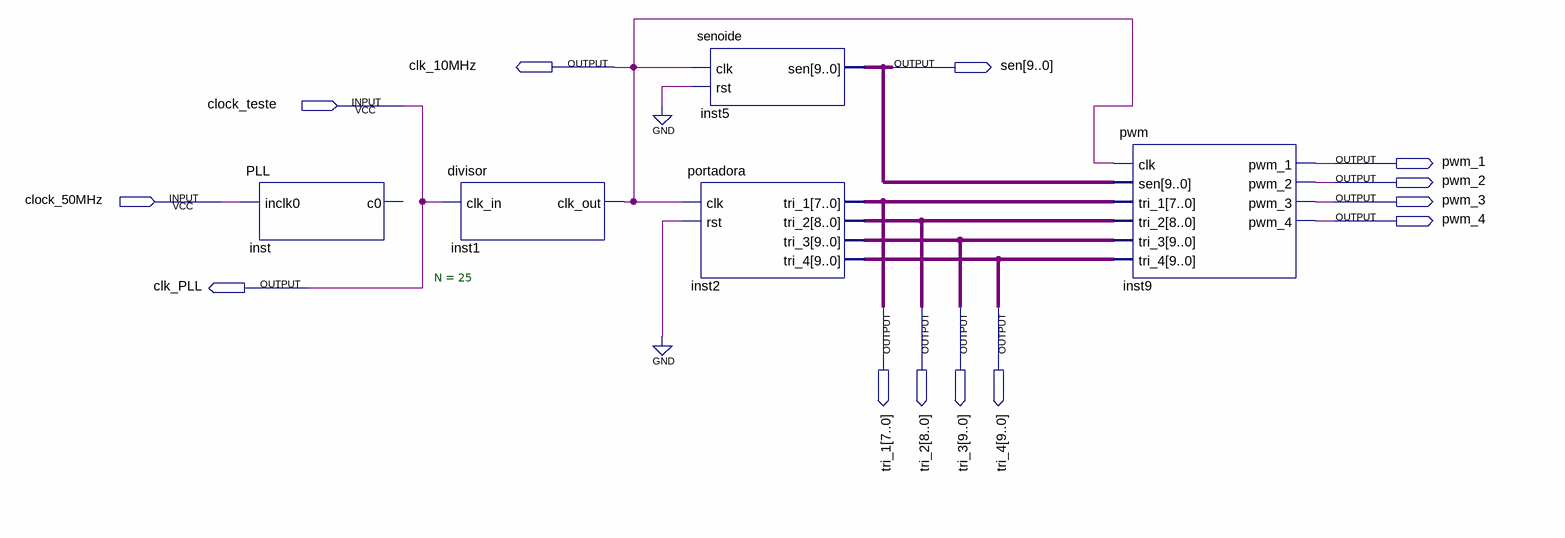
[diagram p0: schematic sheet]
// Quartus schematic main.bdf as structural Verilog: 5 symbols, 13 pins
module main (
  input  clock_teste,
  input  clock_50MHz,
  output clk_10MHz,
  output [9:0] sen,
  output pwm_1,
  output pwm_2,
  output pwm_3,
  output pwm_4,
  output clk_PLL,
  output [7:0] tri_1,
  output [8:0] tri_2,
  output [9:0] tri_3,
  output [9:0] tri_4
);

  PLL inst (.inclk0(clock_50MHz));  // open: c0
  divisor #(.N(25)) inst1 (.clk_in(clock_teste), .clk_out(clk_10MHz));
  senoide inst5 (.clk(clk_10MHz), .rst(1'b0), .sen(sen));
  portadora inst2 (.clk(clk_10MHz), .rst(1'b0), .tri_1(tri_1), .tri_2(tri_2), .tri_3(tri_3), .tri_4(tri_4));
  pwm inst9 (
    .clk(clk_10MHz), .sen(sen), .tri_1(tri_1), .tri_2(tri_2), .tri_3(tri_3), .tri_4(tri_4), .pwm_1(pwm_1),
    .pwm_2(pwm_2), .pwm_3(pwm_3), .pwm_4(pwm_4));

  assign clk_PLL = clock_teste;
endmodule
